# Altium schematic sheet BSPD.SchDoc
size A3
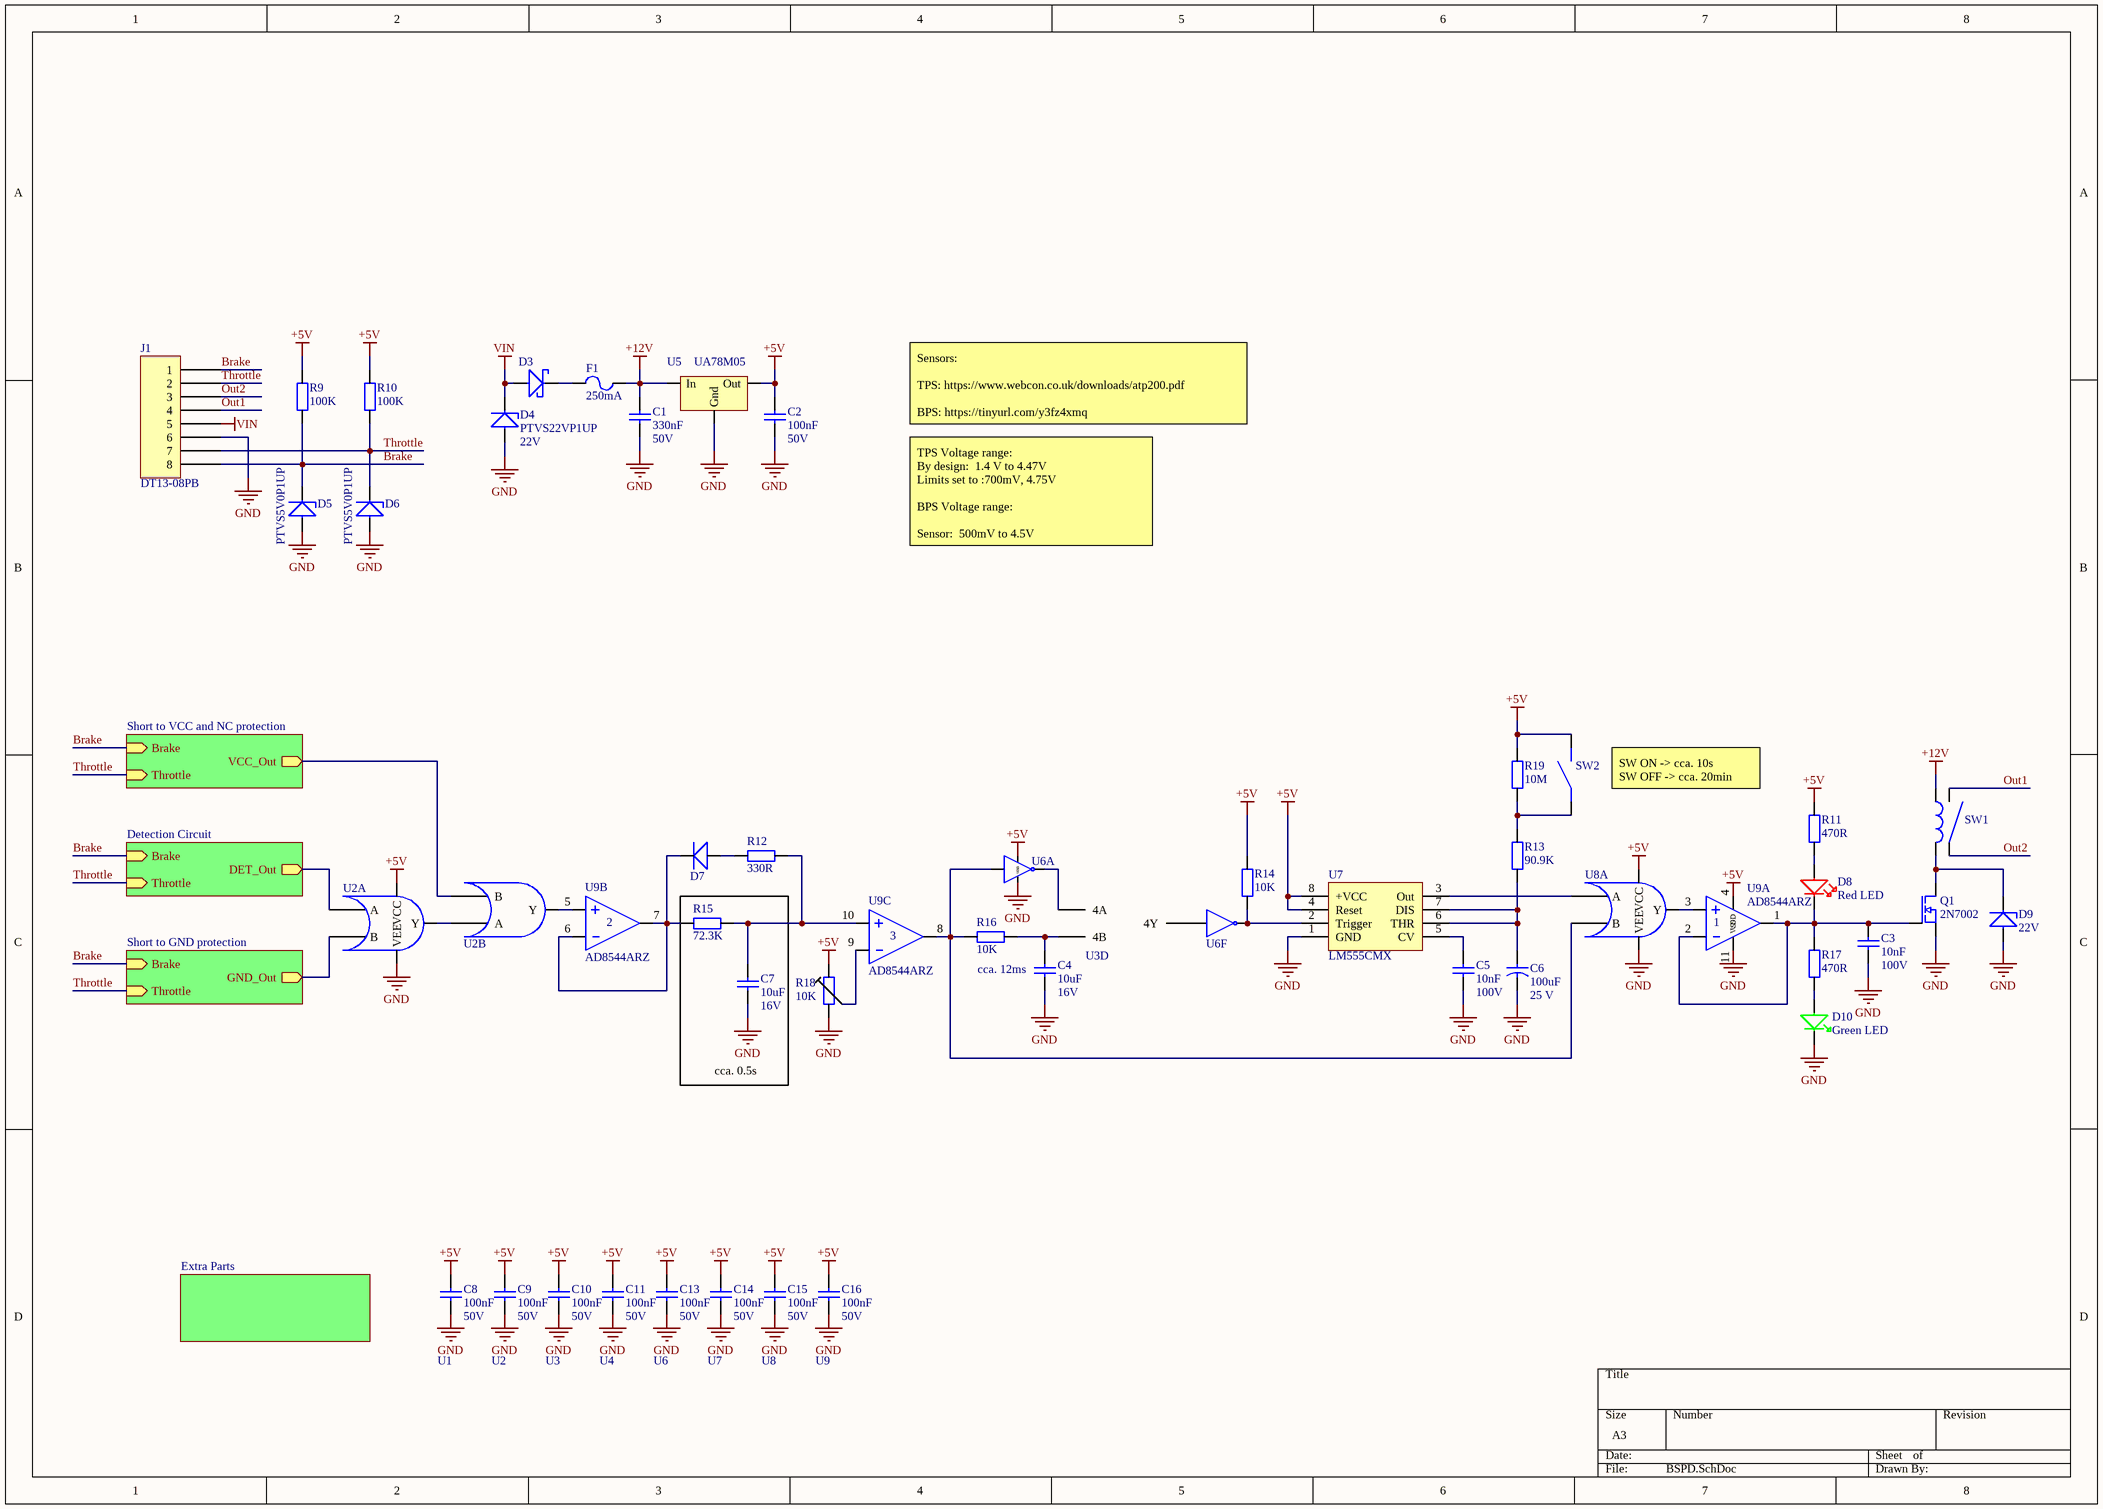
[diagram p0: BSPD.SchDoc]

## Parts
C1  330nF  Voltage Rating: 50V  [CAPC320X160X90L50N]
C2  100nF  Voltage Rating: 50V  [CAPC160X80X87L35N]
C3  10nF  Voltage Rating: 100V  [CAPC160X80X87L35N]
C4  10uF  Voltage Rating: 16V  [CAPC160X80X90L40N]
C5  10nF  Voltage Rating: 100V  [CAPC160X80X87L35N]
C6  100uF  Voltage Rating: 25 V  [CAPAE660X770D660L220X65N]
C7  10uF  Voltage Rating: 16V  [CAPC160X80X90L40N]
C8  100nF  Voltage Rating: 50V  [CAPC160X80X87L35N]
C9  100nF  Voltage Rating: 50V  [CAPC160X80X87L35N]
C10  100nF  Voltage Rating: 50V  [CAPC160X80X87L35N]
C11  100nF  Voltage Rating: 50V  [CAPC160X80X87L35N]
C13  100nF  Voltage Rating: 50V  [CAPC160X80X87L35N]
C14  100nF  Voltage Rating: 50V  [CAPC160X80X87L35N]
C15  100nF  Voltage Rating: 50V  [CAPC160X80X87L35N]
C16  100nF  Voltage Rating: 50V  [CAPC160X80X87L35N]
D3  MBR0540  [SOD375X160X128L31X60N]  (value not drawn)
D4  PTVS22VP1UP  Stand-off Voltage: 22V  [SODFL470X250X110L130X175N]
D5  PTVS5V0P1UP  [SODFL470X250X110L130X175N]
D6  PTVS5V0P1UP  [SODFL470X250X110L130X175N]
D7  MMDL6050T1G  [SOD250X125X100L13X32N]  (value not drawn)
D8  Red LED  [LEDC160X80X50L30N]
D9  Stand-off Voltage: 22V  [SODFL470X250X110L130X175N]  (hidden comment: PTVS22VP1UP)
D10  Green LED  [LEDC160X80X50L30N]
F1  250mA  [FUSC325X165X75L42N]
J1  DT13-08PB  [DT13-08PB]
Q1  2N7002  [SOT23-3P95_230X110L30X43N]
R9  100K  [RESC160X80X50L30N]
R10  100K  [RESC160X80X50L30N]
R11  470R  [RESC160X80X50L30N]
R12  330R  [RESC160X80X50L30N]
R13  90.9K  [RESC160X80X55L25N]
R14  10K  [RESC160X80X50L30N]
R15  72.3K  [RESC160X80X60L30N]
R16  10K  [RESC160X80X50L30N]
R17  470R  [RESC160X80X50L30N]
R18  10K  [RESDFN3_475X200X100L160X130N]
R19  10M  [RESC160X80X55L30N]
SW1  SPST-NO  [655414191282]  (value not drawn)
SW2  DS04-254-2-01BK-SMT-TR  [SW_DS04-254-2-01BK-SMT-TR]  (value not drawn)
U2  CD4071BM  [SOIC14P127_865X600X175L70X42N]  (value not drawn)  (parts A,B of 4)
U3  HEF4081BT  [SOIC14P127_865X600X175L70X42N]  (value not drawn)  (part D of 4)
U5  UA78M05  [SOT223-4P230_700X180L80X75N]
U6  HCF40106YM013TR  [SOIC14P127_865X600X175L88X40N]  (value not drawn)  (parts A,F of 6)
U7  LM555CMX  [SOIC8P127_490X599X175L104X41N]
U8  CD4071BM  [SOIC14P127_865X600X175L70X42N]  (value not drawn)  (part A of 4)
U9  AD8544ARZ  [SOIC14P127_865X600X175L83X41N]  (parts A,B,C of 4)

## Blocks framed on the sheet
cca. 0.5s: C7 R15

## Sub-sheets
Detection Circuit = Detection Circuit.SchDoc: DET_Out (out), Brake (in), Throttle (in)
Extra Parts = Extra Parts.SchDoc: no entries
Short to GND protection = Short to GND protection.SchDoc: GND_Out (out), Brake (in), Throttle (in)
Short to VCC and NC protection = Short to VCC protection.SchDoc: VCC_Out (out), Brake (in), Throttle (in)

## Nets
+5V: C2.2 C8.1 C9.1 C10.1 C11.1 C13.1 C14.1 C15.1 C16.1 R9.2 R10.2 R11.1 R14.2 R18.3 R19.1 SW2.2 U2.14(VCC) U5.3(Out) U6.14(VDD) U7.4(Reset) U7.8(+VCC) U8.14(VCC) U9.4(VDD)
+12V: C1.2 F1.2 SW1.1 U5.1(In)
GND: C1.1 C2.1 C3.1 C4.2 C5.1 C6.2 C7.2 C8.2 C9.2 C10.2 C11.2 C13.2 C14.2 C15.2 C16.2 D4.A D5.A D6.A D9.A D10.C J1.6 Q1.2(S) R18.1 U2.7(VEE) U5.2(Gnd) U6.7(VSS) U7.1(GND) U8.7(VEE) U9.11(VSS)
VIN: D3.A D4.C J1.5
Brake: D5.C J1.1 J1.8 R9.1 ; sheet Detection Circuit/Brake, sheet Short to GND protection/Brake, sheet Short to VCC and NC protection/Brake
Out1: J1.4 SW1.3
Out2: J1.3 SW1.4
Throttle: D6.C J1.2 J1.7 R10.1 ; sheet Detection Circuit/Throttle, sheet Short to GND protection/Throttle, sheet Short to VCC and NC protection/Throttle
NetC3_2: C3.2 D8.C Q1.1(G) R17.1 U9.1 U9.2
NetC4_1: C4.1 R16.1 U3.13(4B)
NetC5_2: C5.2 U7.5(CV)
NetC6_1: C6.1 R13.1 U7.6(THR) U7.7(DIS)
NetC7_1: C7.1 R12.1 R15.1 U9.10
NetD3_C: D3.C F1.1
NetD7_A: D7.A R12.2
NetD7_C: D7.C R15.2 U9.6 U9.7
NetD8_A: D8.A R11.2
NetD9_C: D9.C Q1.3(D) SW1.2
NetD10_A: D10.A R17.2
NetR13_2: R13.2 R19.2 SW2.1
NetR14_1: R14.1 U6.12(L) U7.2(Trigger)
NetR16_2: R16.2 U6.1(A) U8.2(B) U9.8
NetR18_2: R18.2 U9.9
NetU2_1: U2.1(A) ; sheet Detection Circuit/DET_Out
NetU2_2: U2.2(B) ; sheet Short to GND protection/GND_Out
NetU2_3: U2.3(Y) U2.5(A)
NetU2_4: U2.4(Y) U9.5
NetU2_6: U2.6(B) ; sheet Short to VCC and NC protection/VCC_Out
NetU3_11: U3.11(4Y) U6.13(F)
NetU3_12: U3.12(4A) U6.2(G)
NetU7_3: U7.3(Out) U8.1(A)
NetU8_3: U8.3(Y) U9.3

## Notes on the sheet
- Sensors:
  TPS: https://www.webcon.co.uk/downloads/atp200.pdf
  BPS: https://tinyurl.com/y3fz4xmq
- TPS Voltage range:
  By design:  1.4 V to 4.47V
  Limits set to :700mV, 4.75V
  BPS Voltage range:
  Sensor:  500mV to 4.5V
  Limits set to :300mV, 4.75V
- SW ON -> cca. 10s
  SW OFF -> cca. 20min
- (near C4) cca. 12ms
- U1
- U2
- U3
- U4
- U6
- U7
- U8
- U9

## Library data of the parts
C1 = C_1206_330nF_50V: Manufacturer Part Number: 1206B334K500CT; Capacitor Case Style: 1206; ComponentLinkDescription: Datasheet; FR_SN: C_NP-03; Part Number: C_1206_330nF_50V; Value: 330nF; ComponentLinkURL: https://hr.mouser.com/datasheet/2/210/WTC_MLCC_Gen; Supplier Part Number: 791-1206B334K500CT
C2 C8-C11 C13-C16 = C_0603_100nF_50V: Manufacturer Part Number: CC0603MRY5V9BB104; Capacitor Case Style: 0603; ComponentLinkDescription: Datasheet; FR_SN: C_NP-02; Part Number: C_0603_100nF_50V; Value: 100nF; ComponentLinkURL: https://hr.mouser.com/datasheet/2/212/KEM_C1027_X7; Supplier Part Number: 603-C0603MRY5V9BB104
C3 C5 = C_0603_10nF_100V: Manufacturer Part Number: 885012206114; Capacitor Case Style: 0603; ComponentLinkDescription: Datasheet; FR_SN: C_NP-07; Part Number: C_0603_10nF_100V; Value: 10nF; ComponentLinkURL: https://hr.mouser.com/datasheet/2/445/885012206114; Supplier Part Number: 710-885012206114
C4 C7 = C_0603_10uF_16V: Manufacturer Part Number: GRM188R61C106KAALD; Capacitor Case Style: 0603; ComponentLinkDescription: Datasheet; FR_SN: C_NP-12; Part Number: C_0603_10uF_16V; Value: 10uF; ComponentLinkURL: https://hr.mouser.com/datasheet/2/281/murata_03052; Supplier Part Number: 81-GRM188R61C106KALD
C6 = C_100uF_25V: Manufacturer Part Number: 865080445010; Capacitor Case Style: Radial; ComponentLinkDescription: Datasheet; FR_SN: C_P-07; Part Number: C_100uF_25V; Value: 100uF; ComponentLinkURL: https://hr.mouser.com/datasheet/2/445/865080445010-1726566.pdf; Supplier Part Number: 710-865080445010
D3 = MBR0540: Max Reverse Voltage: 40 V; Diode Case Style: SOD-123; Forward Current: 500 mA; ComponentLinkDescription: Datasheet; FR_SN: D_S-01; Part Number: MBR0540; Value: MBR0540; Manufacturer Part Number: MBR0540; ComponentLinkURL: https://hr.mouser.com/datasheet/2/308/MBR0540-1306677.pdf; Supplier Part Number: 512-MBR0540
D4 D9 = TVS_22V: Manufacturer Part Number: PTVS22VP1UP,115; Diode Case Style: SOD-128; Peak Pulse Power: 600W; ComponentLinkDescription: Datasheet; FR_SN: TVS-02; Part Number: TVS_22V; Value: PTVS22VP1UP; ComponentLinkURL: https://hr.mouser.com/datasheet/2/916/PTVSXP1UP_SER-1320701.pdf; Supplier Part Number: 771-PTVS22VP1UP115
D5 D6 = TVS_5V: Part Number: TVS_5V; Manufacturer Part Number: PTVS5V0P1UP,115; Diode Case Style: SOD-128; Stand-off Voltage: 5V; Peak Pulse Power: 600W; ComponentLinkDescription: Datasheet; FR_SN: TVS_04; Value: PTVS5V0P1UP; ComponentLinkURL: https://hr.mouser.com/ProductDetail/Nexperia/PTVS5V0P1UP115?qs=sGAEpiMZZMvD44QvxK4%2FifxZNBzjFSC%252B; Supplier Part Number: 771-PTVS5V0P1UP115
D7 = MMDL6050T1G: Max Reverse Voltage: 70V; Diode Type: Rectifier; Diode Case Style: SOD-323; Reverse Recovery Time: 4ns; Forward Current: 200 mA; ComponentLinkDescription: Datasheet; FR_SN: D-01; Part Number: MMDL6050T1G; Value: MMDL6050T1G; Manufacturer Part Number: MMDL6050T1G; ComponentLinkURL: https://hr.mouser.com/datasheet/2/308/MMDL6050T1-D-1811964.pdf; Supplier Part Number: 863-MMDL6050T1G
D8 = LED_Red_60mcd: Manufacturer Part Number: 150060SS75000; Max Reverse Voltage: 5V; Diode Case Style: 0603; Forward Current: 20mA; ComponentLinkDescription: Datasheet; FR_SN: D_LED-03; Part Number: LED_Red_60mcd; Value: Red LED; Diode Type: LED; ComponentLinkURL: https://hr.mouser.com/datasheet/2/445/150060SS75000-368982.pdf; Supplier Part Number: 710-150060SS75000
D10 = LED_Green_20mcd@12V,1.4K: Manufacturer Part Number: 150060VS55040; Max Reverse Voltage: 5V; Diode Case Style: SMD; Forward Current: 20mA; ComponentLinkDescription: Datasheet; FR_SN: D_LED-02; Part Number: LED_Green_20mcd@12V,1.4K; Value: Green LED; Diode Type: LED; ComponentLinkURL: https://hr.mouser.com/datasheet/2/445/150060VS55040-1313752.pdf; Supplier Part Number: 710-150060VS55040
F1 = F_250mA: Manufacturer Part Number: 0ZCJ0025FF2E; Holding Current: 500mA; Fuse Case Style: 1206; ComponentLinkDescription: Datasheet; FR_SN: F-01; Part Number: F_250mA; Value: 250mA; Tripping Current: 250mA; ComponentLinkURL: https://hr.mouser.com/datasheet/2/643/0ZCJ_Nov2016-1132002.pdf; Supplier Part Number: 530-0ZCJ0025FF2E
J1 = DT13-08PB 2x4: ComponentLinkDescription: Datasheet; FR_SN: J-17; Part Number: DT13-08PB 2x4; Value: DT13-08PB; Manufacturer Part Number: DT13-08PB; ComponentLinkURL: https://www.te.com/commerce/DocumentDelivery/DDEController?Action=srchrtrv&DocNm=DT13-08PX&DocType=Customer+Drawing&DocLang=English&PartCntxt=DT13-08PB&DocFormat=pdf; Supplier Part Number: 571-DT13-08PB
Q1 = Q_N_GSD: On Resistance Rds(on): 1.2 Ohms; Power Dissipation Pd: 200 mW; Continuous Drain Current Id: 120 mA; Drain Source Voltage Uds: 60 V; Transistor Case Style: SOT-23-3; ComponentLinkDescription: Datasheet; FR_SN: T_M-03; Part Number: Q_N_GSD; Value: 2N7002; Manufacturer Part Number: 2N7002; ComponentLinkURL: https://hr.mouser.com/ProductDetail/ON-Semiconductor-Fairchild/2N7002?qs=0dwsXDNhqlz66WJJhrTFjQ%3D%3D; Supplier Part Number: 512-2N7002
R9 R10 = R_0603_100K_0W1_C: Manufacturer Part Number: CRCW0603100KFKEAC; Power Rating: 100mW; Resistor Case Style: 0603; Temperature Coefficient: 100 PPM / C; FR_SN: R-34; Part Number: R_0603_100K_0W1_C; Value: 100K; ComponentLink1URL: https://hr.mouser.com/datasheet/2/427/crcwce3-1223726.pdf; ComponentLink1Description: Datasheet; Supplier Part Number: 71-CRCW0603100KFKEAC
R11 R17 = R_0603_470R_0W33: Manufacturer Part Number: CRCW0603470RJNEAC; Power Rating: 100mW; Resistor Case Style: 0603; Temperature Coefficient: 200 PPM / C; FR_SN: R-03; Part Number: R_0603_470R_0W33; Value: 470R; ComponentLink1URL: https://hr.mouser.com/datasheet/2/219/SG73G-1316861.pdf; ComponentLink1Description: Datasheet; Supplier Part Number: 71-CRCW0603470RJNEAC
R12 = R_0603_330R_0W1: Manufacturer Part Number: CRCW0603330RFKEAC; Power Rating: 100 mW; Resistor Case Style: 0603; Temperature Coefficient: 100 PPM / C; FR_SN: R-26; Part Number: R_0603_330R_0W1; Value: 330R; ComponentLink1URL: https://hr.mouser.com/datasheet/2/427/crcwce3-1223726.pdf; ComponentLink1Description: Datasheet; Supplier Part Number: 71-CRCW0603330RFKEAC
R13 = R_0603_90.9K_0W1: Manufacturer Part Number: RC0603FR-0790K9L; Power Rating: 100mW; Resistor Case Style: 0603; Temperature Coefficient: 100 PPM / C; FR_SN: R-72; Part Number: R_0603_90.9K_0W1; Value: 90.9K; ComponentLink1URL: https://hr.mouser.com/datasheet/2/447/PYu-RC_Group_51_RoHS_L_10-1664068.pdf; ComponentLink1Description: Datasheet; Supplier Part Number: 603-RC0603FR-0790K9L
R14 R16 = R_0603_10K_0W062_P: Manufacturer Part Number: APC0603B10K0N; Power Rating: 62.5mW; Resistor Case Style: 0603; Temperature Coefficient: 25 PPM / C; FR_SN: R-11; Part Number: R_0603_10K_0W062_P; Value: 10K; ComponentLink1URL: https://hr.mouser.com/datasheet/2/303/APC-1-15.34-911303.pdf; ComponentLink1Description: Datasheet; Supplier Part Number: 284-APC0603B10K0N
R15 = R_0603_72.3K_0W062: Manufacturer Part Number: RN731JTTD7232D100; Power Rating: 62.5 mW; Resistor Case Style: 0603; Temperature Coefficient: 100 PPM / C; FR_SN: R-74; Part Number: R_0603_72.3K_0W062; Value: 72.3K; ComponentLink1URL: https://hr.mouser.com/datasheet/2/219/KOA_Speer_RN73__1_-1894048.pdf; ComponentLink1Description: Datasheet; Supplier Part Number: 660-RN731JTD7232D100
R18 = Trimmer_10K_0W250: Manufacturer Part Number: PVG5A103C03B00; Power Rating: 250mW; Resistor Case Style: Vertical; Temperature Coefficient: 150 PPM/C; FR_SN: Trim-02; Part Number: Trimmer_10K_0W250; Value: 10K; ComponentLink1Description: Datasheet; Supplier Part Number: 81-PVG5A103C03B00; ComponentLink1URL: https://hr.mouser.com/datasheet/2/54/pvg5-907351.pdf
R19 = R_0603_10M_0W1: Manufacturer Part Number: CRCW060310M0JNEAC; Power Rating: 100mW; Resistor Case Style: 0603; Temperature Coefficient: 200 PPM / C; FR_SN: R-75; Part Number: R_0603_10M_0W1; Value: 10M; ComponentLink1URL: https://hr.mouser.com/datasheet/2/427/crcwce3-1762584.pdf; ComponentLink1Description: Datasheet; Supplier Part Number: 71-CRCW060310M0JNEAC
SW1 = Relay_Non-L_TH: Manufacturer Part Number: 4-1419128-2; Switch Case Style: Relay; ComponentLinkDescription: Datasheet; FR_SN: SW-03; Part Number: Relay_Non-L_TH; Value: SPST-NO; Type: Non-Latching; Configuration: SPST-NO; ComponentLinkURL: https://www.te.com/commerce/DocumentDelivery/DDEController?Action=srchrtrv&DocNm=1461104&DocType=Customer+Drawing&DocLang=English&PartCntxt=4-1419128-2&DocFormat=pdf; Supplier Part Number: 655-4-1419128-2
SW2 = Switch_1P: Switch Case Style: DIP; Configuration: SPST; ComponentLinkDescription: Datasheet; FR_SN: SW-04; Part Number: Switch_1P; Value: DS04-254-2-01BK-SMT-TR; Type: DIP Switches; Manufacturer Part Number: DS04-254-2-01BK-SMT-TR; ComponentLinkURL: https://hr.mouser.com/datasheet/2/670/ds04_254_smt-1777718.pdf; Supplier Part Number: 490-DS04254201BK-STR
U2 U8 = CD4071BM: IC Case Style: SO-14; ComponentLinkDescription: Datasheet; FR_SN: IC_Misc-21; Part Number: CD4071BM; Value: CD4071BM; Category: Logic OR Gate; Manufacturer Part Number: CD4071BM; ComponentLinkURL: https://www.ti.com/general/docs/suppproductinfo.tsp?distId=26&gotoUrl=http%3A%2F%2Fwww.ti.com%2Flit%2Fgpn%2Fcd4071b; Supplier Part Number: 595-CD4071BM
U3 = HEF4081BT: Manufacturer Part Number: HEF4081BT,653; IC Case Style: SO-14; ComponentLinkDescription: Datasheet; FR_SN: IC_Misc-20; Part Number: HEF4081BT; Value: HEF4081BT; Category: Logic AND Gate; ComponentLinkURL: https://hr.mouser.com/datasheet/2/916/HEF4081B_Q100-1599374.pdf; Supplier Part Number: 771-HEF4081BTD-T
U5 = UA78M05: Manufacturer Part Number: UA78M05CDCYR; Max Input Voltage: 25; Output Current: 0.5A; Output Voltage: 5V; IC Case Style: SOT223; ComponentLinkDescription: Datasheet; FR_SN: IC_Reg-02; Part Number: UA78M05; Value: UA78M05; Category: Fixed Positive Voltage Regulators; ComponentLinkURL: http://www.ti.com/lit/ds/symlink/ua78m.pdf; Supplier Part Number: 595-UA78M05CDCYR
U6 = HCF40106: IC Case Style: SO-14; ComponentLinkDescription: Datasheet; FR_SN: IC_Misc-22; Part Number: HCF40106; Value: HCF40106YM013TR; Category: Inverter; Manufacturer Part Number: HCF40106YM013TR; ComponentLinkURL: https://hr.mouser.com/datasheet/2/389/hcf40106-1849101.pdf; Supplier Part Number: 511-HCF40106YM013TR
U7 = LM555: Manufacturer Part Number: LM555CMX/NOPB; IC Case Style: SOIC-8; ComponentLinkDescription: Datasheet; FR_SN: IC_Misc-09; Part Number: LM555; Value: LM555CMX; Category: Clock & Timer ICs; ComponentLinkURL: http://www.ti.com/lit/ds/symlink/lm555.pdf; Supplier Part Number: 926-LM555CMX/NOPB
U9 = AD8544: Manufacturer Part Number: AD8544ARZ-REEL; IC Case Style: SOIC-14; ComponentLinkDescription: Datasheet; FR_SN: U_Analog-15; Part Number: AD8544; Value: AD8544ARZ; Category: OP Amp; ComponentLinkURL: https://hr.mouser.com/datasheet/2/609/AD8541_8542_8544-1502176.pdf; Supplier Part Number: 584-AD8544ARZ-R